# Altium schematic sheet AIL_REV2.SchDoc
size A4
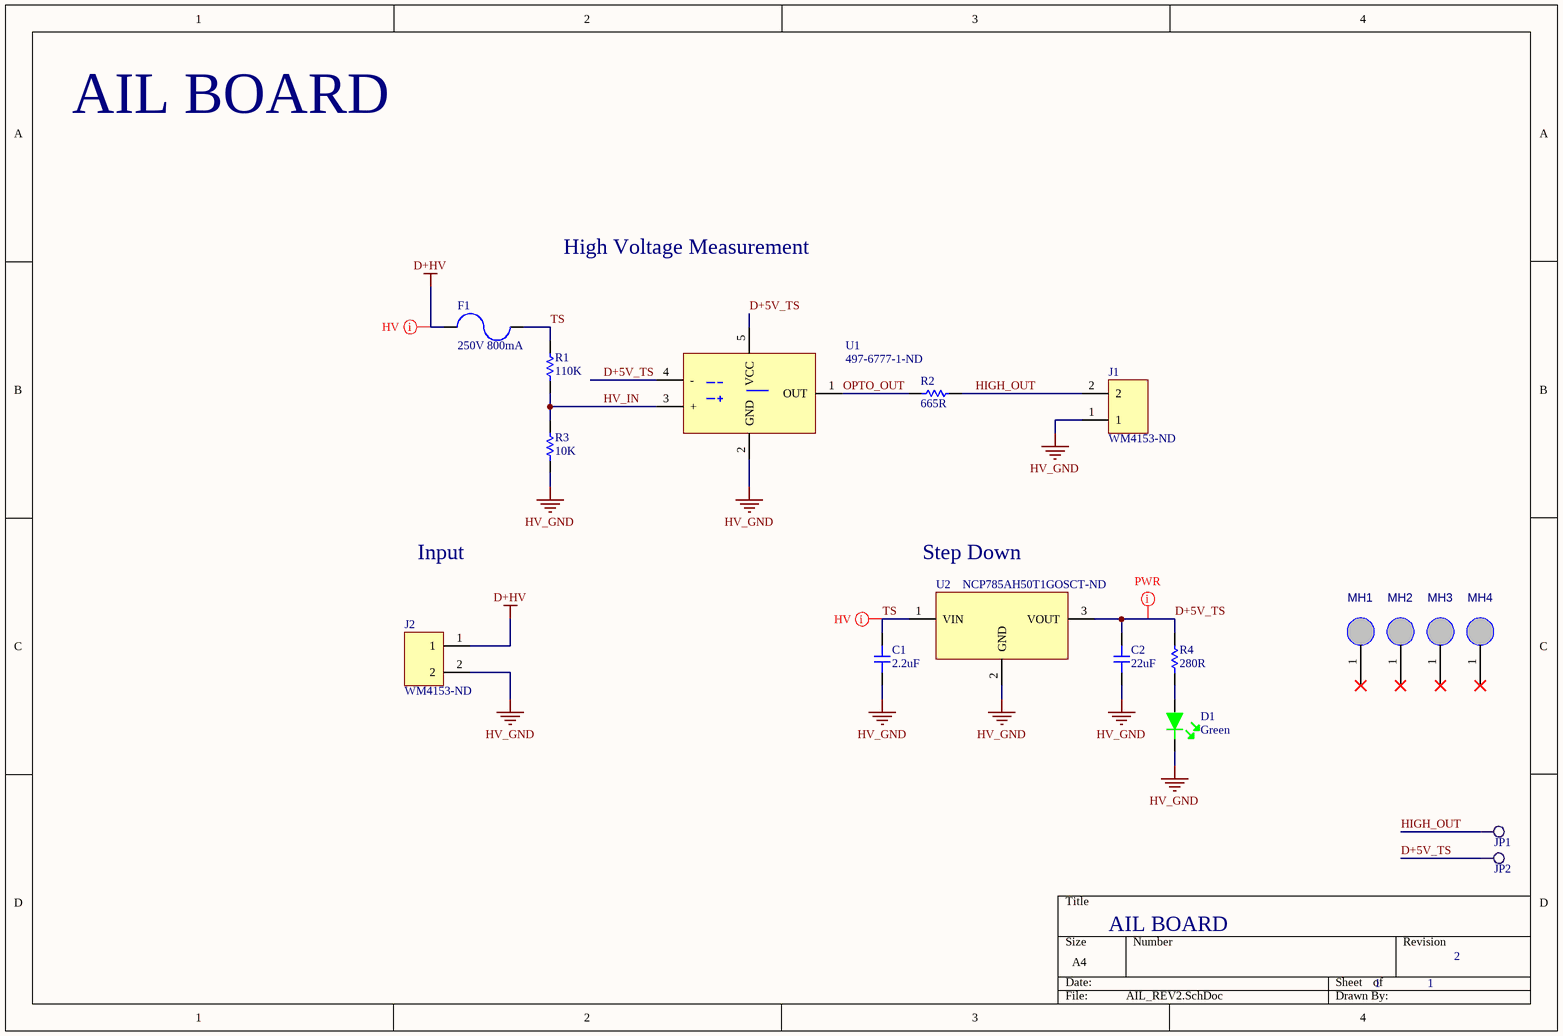
[diagram p0: AIL_REV2.SchDoc]

## Parts
C1  2.2uF  [CAP-2220]
C2  22uF  [CAP-0805]
D1  Green  [LED-0603]
F1  250V 800mA  [Fuse-10x3]
J1  WM4153-ND  [2PIN]
J2  WM4153-ND  [2PIN]
JP1  Testpoint2  [TP2]  (value not drawn)
JP2  Testpoint2  [TP2]  (value not drawn)
MH1  MountingHole  [MH4.2MM]  (value not drawn)
MH2  MountingHole  [MH4.2MM]  (value not drawn)
MH3  MountingHole  [MH4.2MM]  (value not drawn)
MH4  MountingHole  [MH4.2MM]  (value not drawn)
R1  110K  [RES-0805]
R2  665R  [RES-0603]
R3  10K  [RES-0805]
R4  280R  [RES-0805]
U1  497-6777-1-ND  [SOT-23-5]
U2  NCP785AH50T1GOSCT-ND  [SOT-89]

## Nets
D+HV: F1.1 J2.1
HV_GND: C1.1 C2.1 D1.2 J1.1 J2.2 R3.1 U1.2(GND) U2.2(GND)
D+5V_TS: C2.2 JP2.1 R4.2 U1.4(-) U1.5(VCC) U2.3(VOUT)
HIGH_OUT: J1.2 JP1.1 R2.2
HV_IN: R1.1 R3.2 U1.3(+)
OPTO_OUT: R2.1 U1.1(OUT)
TS: C1.2 F1.2 R1.2 U2.1(VIN)
NetD1_1: D1.1 R4.1

Not connected (* = marked no-connect by the designer): MH1 1*; MH2 1*; MH3 1*; MH4 1*

## Layout directives
mark named HV: D+HV, TS
mark named PWR: D+5V_TS

## Notes on the sheet
- AIL BOARD
- High Voltage Measurement
- Input
- (near U2) Step Down
- 1
- 2

## Library data of the parts
C1 = 2220-2.2uF-450V: CAP CER 2.2UF 450V X6S 2220; Manufacturer: TDK; Manufacturer Part Number: C5750X6S2W225K250KA; Tolerance: 10%; Supplier 1: Digi-Key; Stock 1: 8149; Pricing 1: 1=3.66, 10=2.957, 100=2.258 (USD); Mount: Surface Mount; Case/Package: 2220; Weight: 0.016932oz; Case Code (Metric): 5750; Case Code (Imperial): 2220; Min Operating Temperature: -55°C; Max Operating Temperature: 105°C; Package Quantity: 1; Capacitance: 2.2uF; Voltage Rating: 450V; Packaging: Tape and Reel; Dielectric: X6S; Termination: SMD/SMT; Voltage Rating (DC): 450V; Length: 5.7mm; Height: 2.5mm; Width: 0.197inch; Thickness: 0.11inch; Depth: 5mm; Radiation Hardening: No; REACH SVHC: No SVHC; Lead Free: Lead Free; ComponentLink1URL: http://product.tdk.com/capacitor/mlcc/en/documents/mlcc_commercial_midvoltage_en.pdf?src-supplier=Avnet+Europe; ComponentLink1Description: http://product.tdk.com/capacitor/mlcc/en/documents/mlcc_commercial_midvoltage_en.pdf?src-supplier=Avnet+Europe; Supplier Part Number 1: 445-7781-6-ND
C2 = 0805-22uF-10V: CAP CER 22UF 10V X5R 0805; Manufacturer: KEMET; Manufacturer Part Number: C0805C226M8PACTU; Dielectric Material: Ceramic; Dissipation Factor: 10%; Tolerance: 20%; Supplier 1: Digi-Key; Stock 1: 29030; Pricing 1: 1=0.47, 10=0.331, 100=0.2179, 500=0.16142, 1000=0.1372 (USD); Mount: Surface Mount; Case/Package: 0805; Case Code (Metric): 2012; Case Code (Imperial): 0805; Min Operating Temperature: -55°C; Max Operating Temperature: 85°C; Packaging: Tape and Reel; Capacitance: 22uF; Voltage Rating: 10V; Voltage: 10V; Dielectric: X5R; Termination: Solder; Voltage Rating (DC): 10V; Length: 0.079inch; Height: 1.25mm; Width: 0.049inch; Thickness: 0.055inch; Depth: 1.25mm; Lead Free: Lead Free; ComponentLink1URL: http://www.farnell.com/datasheets/2746360.pdf?src-supplier=Newark; ComponentLink1Description: http://www.farnell.com/datasheets/2746360.pdf?src-supplier=Newark; ComponentLink2URL: http://www.farnell.com/datasheets/2746360.pdf?src-supplier=Farnell; ComponentLink2Description: http://www.farnell.com/datasheets/2746360.pdf?src-supplier=Farnell; ComponentLink3URL: http://www.farnell.com/datasheets/2746360.pdf?src-supplier=Element14; ComponentLink3Description: http://www.farnell.com/datasheets/2746360.pdf?src-supplier=Element14; ComponentLink4URL: https://api.kemet.com/component-edge/download/datasheet/C0805C226M8PAC7800.pdf?src-supplier=Digi-Key; ComponentLink4Description: https://api.kemet.com/component-edge/download/datasheet/C0805C226M8PAC7800.pdf?src-supplier=Digi-Key; ComponentLink5URL: http://www.alliedelec.com/m/d/f3c02ddb98afa3dd1adcb801109671e9.pdf?src-supplier=Allied+Electronics; ComponentLink5Description: http://www.alliedelec.com/m/d/f3c02ddb98afa3dd1adcb801109671e9.pdf?src-supplier=Allied+Electronics; Supplier Part Number 1: 399-12069-6-ND
D1 = LED-Green: LED GREEN CLEAR 0603 SMD; Manufacturer: Wurth Electronics; Manufacturer Part Number: 150060VS75000; Luminous Intensity: 40mcd; Viewing Angle: 140°; Forward Voltage: 2V; Wavelength: 570nm; Lens Style: Clear,Rectangular; Forward Current: 30mA; Test Current: 20mA; Supplier 1: Digi-Key; Stock 1: 118118; Pricing 1: 1=0.14, 50=0.133, 100=0.114, 500=0.099 (USD); Mount: Surface Mount; Case/Package: 0603; Number of Pins: 2; Color: Green; Case Code (Metric): 1608; Case Code (Imperial): 0603; Min Operating Temperature: -40°C; Max Operating Temperature: 85°C; Package Quantity: 1; Packaging: Tape and Reel; Dominant Wavelength: 570nm; Length: 1.6mm; Height: 0.7mm; Width: 0.8mm; REACH SVHC: Unknown; ComponentLink1URL: https://katalog.we-online.de/led/datasheet/150060VS75000.pdf?src-supplier=Digi-Key; ComponentLink1Description: https://katalog.we-online.de/led/datasheet/150060VS75000.pdf?src-supplier=Digi-Key; Supplier Part Number 1: 732-4980-1-ND
F1 = Fuse 250V-0.8A: FUSE SMT 3912 FAST 250V 800MA; Manufacturer: Bel; Manufacturer Part Number: 0678D0800-02; Fuse Type: Board Mount (Cartridge Style Excluded); Voltage Rating (AC): 350V; DC Cold Resistance: 380mR; Approvals: cURus; Supplier 1: Digi-Key; Stock 1: 1992; Pricing 1: 1=0.91, 5=0.884, 10=0.827, 50=0.684, 100=0.57, 250=0.55576, 500=0.47026, 1000=0.41325 (USD); Mount: Surface Mount; Case/Package: SMD/SMT; Min Operating Temperature: -55°C; Max Operating Temperature: 125°C; Packaging: Tape and Reel; Current Rating: 800mA; Voltage Rating (DC): 250V; ComponentLink1URL: https://media.digikey.com/pdf/Data%20Sheets/Bel%20Fuse%20PDFs/0678D_Series.pdf?src-supplier=Digi-Key; ComponentLink1Description: https://media.digikey.com/pdf/Data%20Sheets/Bel%20Fuse%20PDFs/0678D_Series.pdf?src-supplier=Digi-Key
J1 J2 = 2PIN: CONN HEADER R/A 2POS 2.54MM; Manufacturer: Molex; Manufacturer Part Number: 0705530106; Number of Positions: 2; Contact Resistance: 30mR; Connector Type: Male Pin; Supplier 1: Digi-Key; Stock 1: 2224; Pricing 1: 1=1.38, 10=1.25, 100=1.071, 500=0.8925, 1000=0.765, 5000=0.6783, 10000=0.663 (USD); Mount: Through Hole; Housing Material: Polyester; Contact Plating: Gold; Contact Material: Bronze; Color: Black; Housing Color: Black; Min Operating Temperature: -40°C; Max Operating Temperature: 105°C; Number of Rows: 1; Packaging: Rail/Tube; Termination: Solder; Number of Contacts: 2; Orientation: Right Angle; Length: 7.37mm; Pitch: 2.54mm; Depth: 13.59mm; Contact Mating Length: 0.24inch; ComponentLink1URL: http://www.molex.com/webdocs/datasheets/pdf/en-us/0705530106_PCB_HEADERS.pdf?src-supplier=Avnet+Asia; ComponentLink1Description: http://www.molex.com/webdocs/datasheets/pdf/en-us/0705530106_PCB_HEADERS.pdf?src-supplier=Avnet+Asia; ComponentLink2URL: https://www.molex.com/pdm_docs/ps/PS-70400.pdf?src-supplier=Digi-Key; ComponentLink2Description: https://www.molex.com/pdm_docs/ps/PS-70400.pdf?src-supplier=Digi-Key; Supplier Part Number 1: WM4153-ND
JP1 JP2 = Testpoint2: Single layer pad TP
MH1-MH4 = MH4.2mm: Mounting hole, 4.2mm; Case: TH
R1 = 0805-110KR: RES SMD 110K OHM 1% 1/8W 0805; Manufacturer: Yageo; Manufacturer Part Number: RC0805FR-07110KL; Power Rating: 125mW; Resistance: 110kR; Voltage Rating: 150V; Temperature Coefficient: 100ppm/°C; ComponentLink1URL: http://www.yageo.ru/pdf/RC0805.pdf?src-supplier=Future+Electronics; ComponentLink1Description: http://www.yageo.ru/pdf/RC0805.pdf?src-supplier=Future+Electronics; ComponentLink2URL: http://www.mouser.com/ds/2/447/Yageo_08112016_RC0805-968729.pdf?src-supplier=Mouser; ComponentLink2Description: http://www.mouser.com/ds/2/447/Yageo_08112016_RC0805-968729.pdf?src-supplier=Mouser; ComponentLink3URL: http://www.yageo.com/documents/recent/PYu-RC_Group_51_RoHS_L_9.pdf?src-supplier=Digi-Key; ComponentLink3Description: http://www.yageo.com/documents/recent/PYu-RC_Group_51_RoHS_L_9.pdf?src-supplier=Digi-Key; ComponentLink4URL: http://www.yageo.com/documents/recent/PYu-RC_Group_51_RoHS_L_10.pdf?src-supplier=Digi-Key; ComponentLink4Description: http://www.yageo.com/documents/recent/PYu-RC_Group_51_RoHS_L_10.pdf?src-supplier=Digi-Key; ComponentLink5URL: http://documents.rs-components.com/techlib://itc_doclist_GB.htm?stockno=6185191&src-supplier=RSComponents; ComponentLink5Description: http://documents.rs-components.com/techlib://itc_doclist_GB.htm?stockno=6185191&src-supplier=RSComponents; Supplier 1: Digi-Key; Stock 1: 344300; Pricing 1: 1=0.1, 10=0.04, 100=0.0163, 1000=0.00731, 2500=0.00635 (USD); Mount: Surface Mount; Case/Package: 0805; Case Code (Imperial): 0805; Case Code (Metric): 2012; Min Operating Temperature: -55°C; Max Operating Temperature: 155°C; Tolerance: 1%; Packaging: Tape and Reel; Package Quantity: 5000; Termination: SMD/SMT; Composition: Thick Film; Military Standard: Not; Voltage Rating (DC): 150V; Number of Terminations: 2; Max Power Dissipation: 125mW; Features: Moisture Resistant; Working Voltage: 150V; Length: 2mm; Height: 0.024inch; Width: 0.049inch; Depth: 1.25mm; Lead Free: Lead Free; Supplier Part Number 1: 311-110KCRDKR-ND
R2 = 0603-665R: RES SMD 665 OHM 1% 1/10W 0603; Manufacturer: Yageo; Manufacturer Part Number: RC0603FR-07665RL; Power Rating: 100mW; Voltage Rating: 75V; Temperature Coefficient: 100ppm/°C; Voltage Rating (DC): 50V; Supplier 1: Digi-Key; Stock 1: 143871; Pricing 1: 1=0.1, 10=0.023, 100=0.0094, 1000=0.00421, 2500=0.00366 (USD); Case/Package: 0603; Weight: 7.1E-05oz; Case Code (Imperial): 0603; Case Code (Metric): 1608; Contact Plating: Tin,Matte; Min Operating Temperature: -55°C; Max Operating Temperature: 155°C; Resistance: 665R; Tolerance: 1%; Packaging: Tape and Reel; Termination: SMD/SMT; Composition: Thick Film; Military Standard: Not; Package Quantity: 1; Number of Terminations: 2; Max Power Dissipation: 100mW; Features: Moisture Resistant; Length: 1.6mm; Height: 0.022inch; Width: 0.8mm; Depth: 0.8mm; Lead Free: Lead Free; ComponentLink1URL: http://www.yageo.com/documents/recent/PYu-RC_Group_51_RoHS_L_9.pdf?src-supplier=Digi-Key; ComponentLink1Description: http://www.yageo.com/documents/recent/PYu-RC_Group_51_RoHS_L_9.pdf?src-supplier=Digi-Key; ComponentLink2URL: http://www.yageo.com/documents/recent/PYu-RC0603_51_RoHS_L_4.pdf?src-supplier=Avnet; ComponentLink2Description: http://www.yageo.com/documents/recent/PYu-RC0603_51_RoHS_L_4.pdf?src-supplier=Avnet; ComponentLink3URL: http://www.yageo.com/documents/recent/PYu-RC_Group_51_RoHS_L_10.pdf?src-supplier=Digi-Key; ComponentLink3Description: http://www.yageo.com/documents/recent/PYu-RC_Group_51_RoHS_L_10.pdf?src-supplier=Digi-Key; ComponentLink4URL: http://www.yageo.com/documents/recent/PYu-RC0603_51_RoHS_L_4.pdf?src-supplier=Avnet+Europe; ComponentLink4Description: http://www.yageo.com/documents/recent/PYu-RC0603_51_RoHS_L_4.pdf?src-supplier=Avnet+Europe; Supplier Part Number 1: 311-665HRDKR-ND
R3 = 0805-10KR: RES SMD 10K OHM 1% 1/8W 0805; Manufacturer: Yageo; Manufacturer Part Number: RC0805FR-0710KL; Resistance: 10kR; Temperature Coefficient: 100ppm/°C; Power Rating: 125mW; Voltage Rating: 150V; Supplier 1: Digi-Key; Stock 1: 26112993; Pricing 1: 1=0.1, 10=0.04, 100=0.0163, 1000=0.00731, 2500=0.00635 (USD); Case/Package: 0805; Case Code (Imperial): 0805; Case Code (Metric): 2012; Min Operating Temperature: -55°C; Max Operating Temperature: 155°C; Packaging: Tape and Reel; Tolerance: 1%; Composition: Thick Film; Package Quantity: 1; Termination: SMD/SMT; Number of Terminations: 2; Military Standard: Not; Max Power Dissipation: 125mW; Features: Moisture Resistant; Length: 2mm; Height: 0.024inch; Width: 0.049inch; Depth: 1.25mm; REACH SVHC: Unknown; Lead Free: Lead Free; ComponentLink1URL: http://www.yageo.com/documents/recent/PYu-RC_Group_51_RoHS_L_9.pdf?src-supplier=Mouser; ComponentLink1Description: http://www.yageo.com/documents/recent/PYu-RC_Group_51_RoHS_L_9.pdf?src-supplier=Mouser; ComponentLink2URL: http://www.farnell.com/datasheets/2167052.pdf?src-supplier=Element14; ComponentLink2Description: http://www.farnell.com/datasheets/2167052.pdf?src-supplier=Element14; ComponentLink3URL: http://www.yageo.com/documents/recent/PYu-RC_Group_51_RoHS_L_10.pdf?src-supplier=Digi-Key; ComponentLink3Description: http://www.yageo.com/documents/recent/PYu-RC_Group_51_RoHS_L_10.pdf?src-supplier=Digi-Key; ComponentLink4URL: http://www.yageo.ru/pdf/RC0805.pdf?src-supplier=Future+Electronics; ComponentLink4Description: http://www.yageo.ru/pdf/RC0805.pdf?src-supplier=Future+Electronics; Supplier Part Number 1: 311-10.0KCRCT-ND
R4 = 0805-280R: RES SMD 280 OHM 1% 1/8W 0805; Manufacturer: Yageo; Manufacturer Part Number: RC0805FR-07280RL; Temperature Coefficient: 100ppm/°C; Max Power Dissipation: 125mW; Voltage Rating (DC): 150V; Supplier 1: Digi-Key; Stock 1: 43663; Pricing 1: 1=0.1, 10=0.04, 100=0.0163, 1000=0.00731, 2500=0.00635 (USD); Case/Package: 0805; Case Code (Imperial): 0805; Case Code (Metric): 2012; Min Operating Temperature: -55°C; Max Operating Temperature: 155°C; Package Quantity: 1; Resistance: 280R; Tolerance: 1%; Packaging: Tape and Reel; Composition: Thick Film; Number of Terminations: 2; Features: Moisture Resistant; Power Rating: 125mW; Voltage Rating: 150V; Termination: SMD/SMT; Military Standard: Not; Length: 2mm; Height: 0.024inch; Width: 1.25mm; Depth: 1.25mm; Lead Free: Lead Free; ComponentLink1URL: http://www.yageo.ru/pdf/RC0805.pdf?src-supplier=Mouser; ComponentLink1Description: http://www.yageo.ru/pdf/RC0805.pdf?src-supplier=Mouser; ComponentLink2URL: http://www.yageo.ru/pdf/RC0805.pdf?src-supplier=Future+Electronics; ComponentLink2Description: http://www.yageo.ru/pdf/RC0805.pdf?src-supplier=Future+Electronics; ComponentLink3URL: http://www.yageo.com.tw/exep/pages/download/literatures/PYu-R_INT-thick_7.pdf?src-supplier=Digi-Key; ComponentLink3Description: http://www.yageo.com.tw/exep/pages/download/literatures/PYu-R_INT-thick_7.pdf?src-supplier=Digi-Key; ComponentLink4URL: http://www.yageo.com/documents/recent/PYu-RC_Group_51_RoHS_L_9.pdf?src-supplier=Digi-Key; ComponentLink4Description: http://www.yageo.com/documents/recent/PYu-RC_Group_51_RoHS_L_9.pdf?src-supplier=Digi-Key; Supplier Part Number 1: 311-280CRDKR-ND
U1 = Compare-TS861ILT: IC COMPARATOR R-R MCRPWR SOT23-5; Manufacturer: STMicroelectronics; Voltage Gain: 240dB; Min Supply Voltage: 2.7V; Max Supply Voltage: 10V; Number of Channels: 1; Max Power Dissipation: 500mW; Nominal Supply Current: 14uA; Common Mode Rejection Ratio: 70dB; Input Offset Voltage (Vos): 15mV; Input Bias Current: 300pA; Quiescent Current: 16uA; Propagation Delay: 2us; Max Supply Current: 12uA; Output Current per Channel: 5mA; Response Time: 500ns; Power Supply Rejection Ratio (PSRR): 80dB; Supplier 1: Digi-Key; Manufacturer Part Number: TS861ILT; Stock 1: 14868; Pricing 1: 1=0.78, 10=0.682, 25=0.6412, 100=0.486, 250=0.4136, 500=0.39292, 1000=0.29986 (USD); Mount: Surface Mount; Case/Package: SOT-23; Number of Pins: 5; Min Operating Temperature: -40°C; Max Operating Temperature: 85°C; Package Quantity: 3000; Number of Elements: 1; Packaging: Tape and Reel; Max Input Current: 300pA; Power Dissipation: 500mW; Output Current: 5mA; Type: General Purpose; Radiation Hardening: No; REACH SVHC: No SVHC; Lead Free: Lead Free; ComponentLink1URL: http://www.farnell.com/datasheets/1690531.pdf?src-supplier=Element14; ComponentLink1Description: http://www.farnell.com/datasheets/1690531.pdf?src-supplier=Element14; ComponentLink2URL: http://www.st.com/content/ccc/resource/technical/document/datasheet/dd/d1/7d/d5/d5/ce/49/c5/CD00001705.pdf/files/CD00001705.pdf/jcr:content/translations/en.CD00001705.pdf?src-supplier=Digi-Key; ComponentLink2Description: http://www.st.com/content/ccc/resource/technical/document/datasheet/dd/d1/7d/d5/d5/ce/49/c5/CD00001705.pdf/files/CD00001705.pdf/jcr:content/translations/en.CD00001705.pdf?src-supplier=Digi-Key; ComponentLink3URL: http://www.mouser.com/ds/2/389/ts861-957384.pdf?src-supplier=Mouser; ComponentLink3Description: http://www.mouser.com/ds/2/389/ts861-957384.pdf?src-supplier=Mouser; ComponentLink4URL: https://www.verical.com/server-webapp/html/getDatasheet?partID=160028&src-supplier=Verical; ComponentLink4Description: https://www.verical.com/server-webapp/html/getDatasheet?partID=160028&src-supplier=Verical; ComponentLink5URL: http://www.produktinfo.conrad.com/datenblaetter/1100000-1199999/001185659-da-01-en-IC_COMPARATOR_R_R_TS861ILT_SOT_23_5_STM.pdf?src-supplier=Conrad; ComponentLink5Description: http://www.produktinfo.conrad.com/datenblaetter/1100000-1199999/001185659-da-01-en-IC_COMPARATOR_R_R_TS861ILT_SOT_23_5_STM.pdf?src-supplier=Conrad; Supplier Part Number 1: 497-6777-6-ND
U2 = LDO-12V-10mA: IC REG LINEAR 5V 10MA SOT89-3; Manufacturer: ON Semiconductor; Manufacturer Part Number: NCP785AH120T1G; Output Voltage: 12V; Number of Regulators: 1; Min Current Limit: 10.5mA; Min Input Voltage (DC): 55V; Max Input Voltage (DC): 450V; Min Input Voltage: 85V; Polarity: Positive; Reference Voltage: 1.25V; Quiescent Current: 22uA; Accuracy: 5%; Output Type: Fixed; Power Supply Rejection Ratio (PSRR): 70dB; Mount: Surface Mount; Case/Package: SOT-89; Number of Pins: 3; Min Operating Temperature: -40°C; Max Operating Temperature: 85°C; Packaging: Cut Tape; Output Current: 10mA; Nominal Output Voltage: 12V; Max Input Voltage: 450V; Number of Outputs: 1; Length: 4.6mm; Height: 1.6mm; Width: 2.6mm; REACH SVHC: No SVHC; Lead Free: Lead Free; ComponentLink1URL: http://www.onsemi.com/pub/Collateral/NCP785A-D.PDF?src-supplier=Digi-Key; ComponentLink1Description: http://www.onsemi.com/pub/Collateral/NCP785A-D.PDF?src-supplier=Digi-Key; ComponentLink2URL: http://www.farnell.com/datasheets/1948370.pdf?src-supplier=Farnell; ComponentLink2Description: http://www.farnell.com/datasheets/1948370.pdf?src-supplier=Farnell; ComponentLink3URL: http://www.farnell.com/datasheets/1948370.pdf?src-supplier=Element14; ComponentLink3Description: http://www.farnell.com/datasheets/1948370.pdf?src-supplier=Element14; ComponentLink4URL: http://uk.rs-online.com/webdocs/141c/0900766b8141c022.pdf?src-supplier=RSComponents; ComponentLink4Description: http://uk.rs-online.com/webdocs/141c/0900766b8141c022.pdf?src-supplier=RSComponents; ComponentLink5URL: http://www.onsemi.com/pub/Collateral/NCP785A-D.PDF?src-supplier=Avnet; ComponentLink5Description: http://www.onsemi.com/pub/Collateral/NCP785A-D.PDF?src-supplier=Avnet; Supplier 1: Digi-Key; Stock 1: 1643; Pricing 1: 1=0.83, 10=0.738, 25=0.7, 100=0.5375, 250=0.475, 500=0.45, 1000=0.35 (USD); Weight: 0.004603oz; Contact Plating: Tin,Matte; Max Output Current: 10mA; Package Quantity: 2500; ComponentLink6URL: http://www.mouser.com/ds/2/308/NCP785A-D-532012.pdf?src-supplier=Mouser; ComponentLink6Description: http://www.mouser.com/ds/2/308/NCP785A-D-532012.pdf?src-supplier=Mouser; ComponentLink7URL: http://www.farnell.com/datasheets/2578399.pdf?src-supplier=Newark; ComponentLink7Description: http://www.farnell.com/datasheets/2578399.pdf?src-supplier=Newark; ComponentLink8URL: http://www.onsemi.com/pub/Collateral/NCP785A-D.PDF?src-supplier=Avnet+Asia; ComponentLink8Description: http://www.onsemi.com/pub/Collateral/NCP785A-D.PDF?src-supplier=Avnet+Asia; Supplier Part Number 1: NCP785AH50T1GOSDKR-ND